# Altium project EVB-NORA-B2.PrjPcb (part 2 of 2)

## Sheet EVB-NORA-B2_SCHEM_0006_PinHeaders_ULED.SchDoc
size A3; DocumentNumber: 4; SheetNumber: 7; SheetTotal: 8
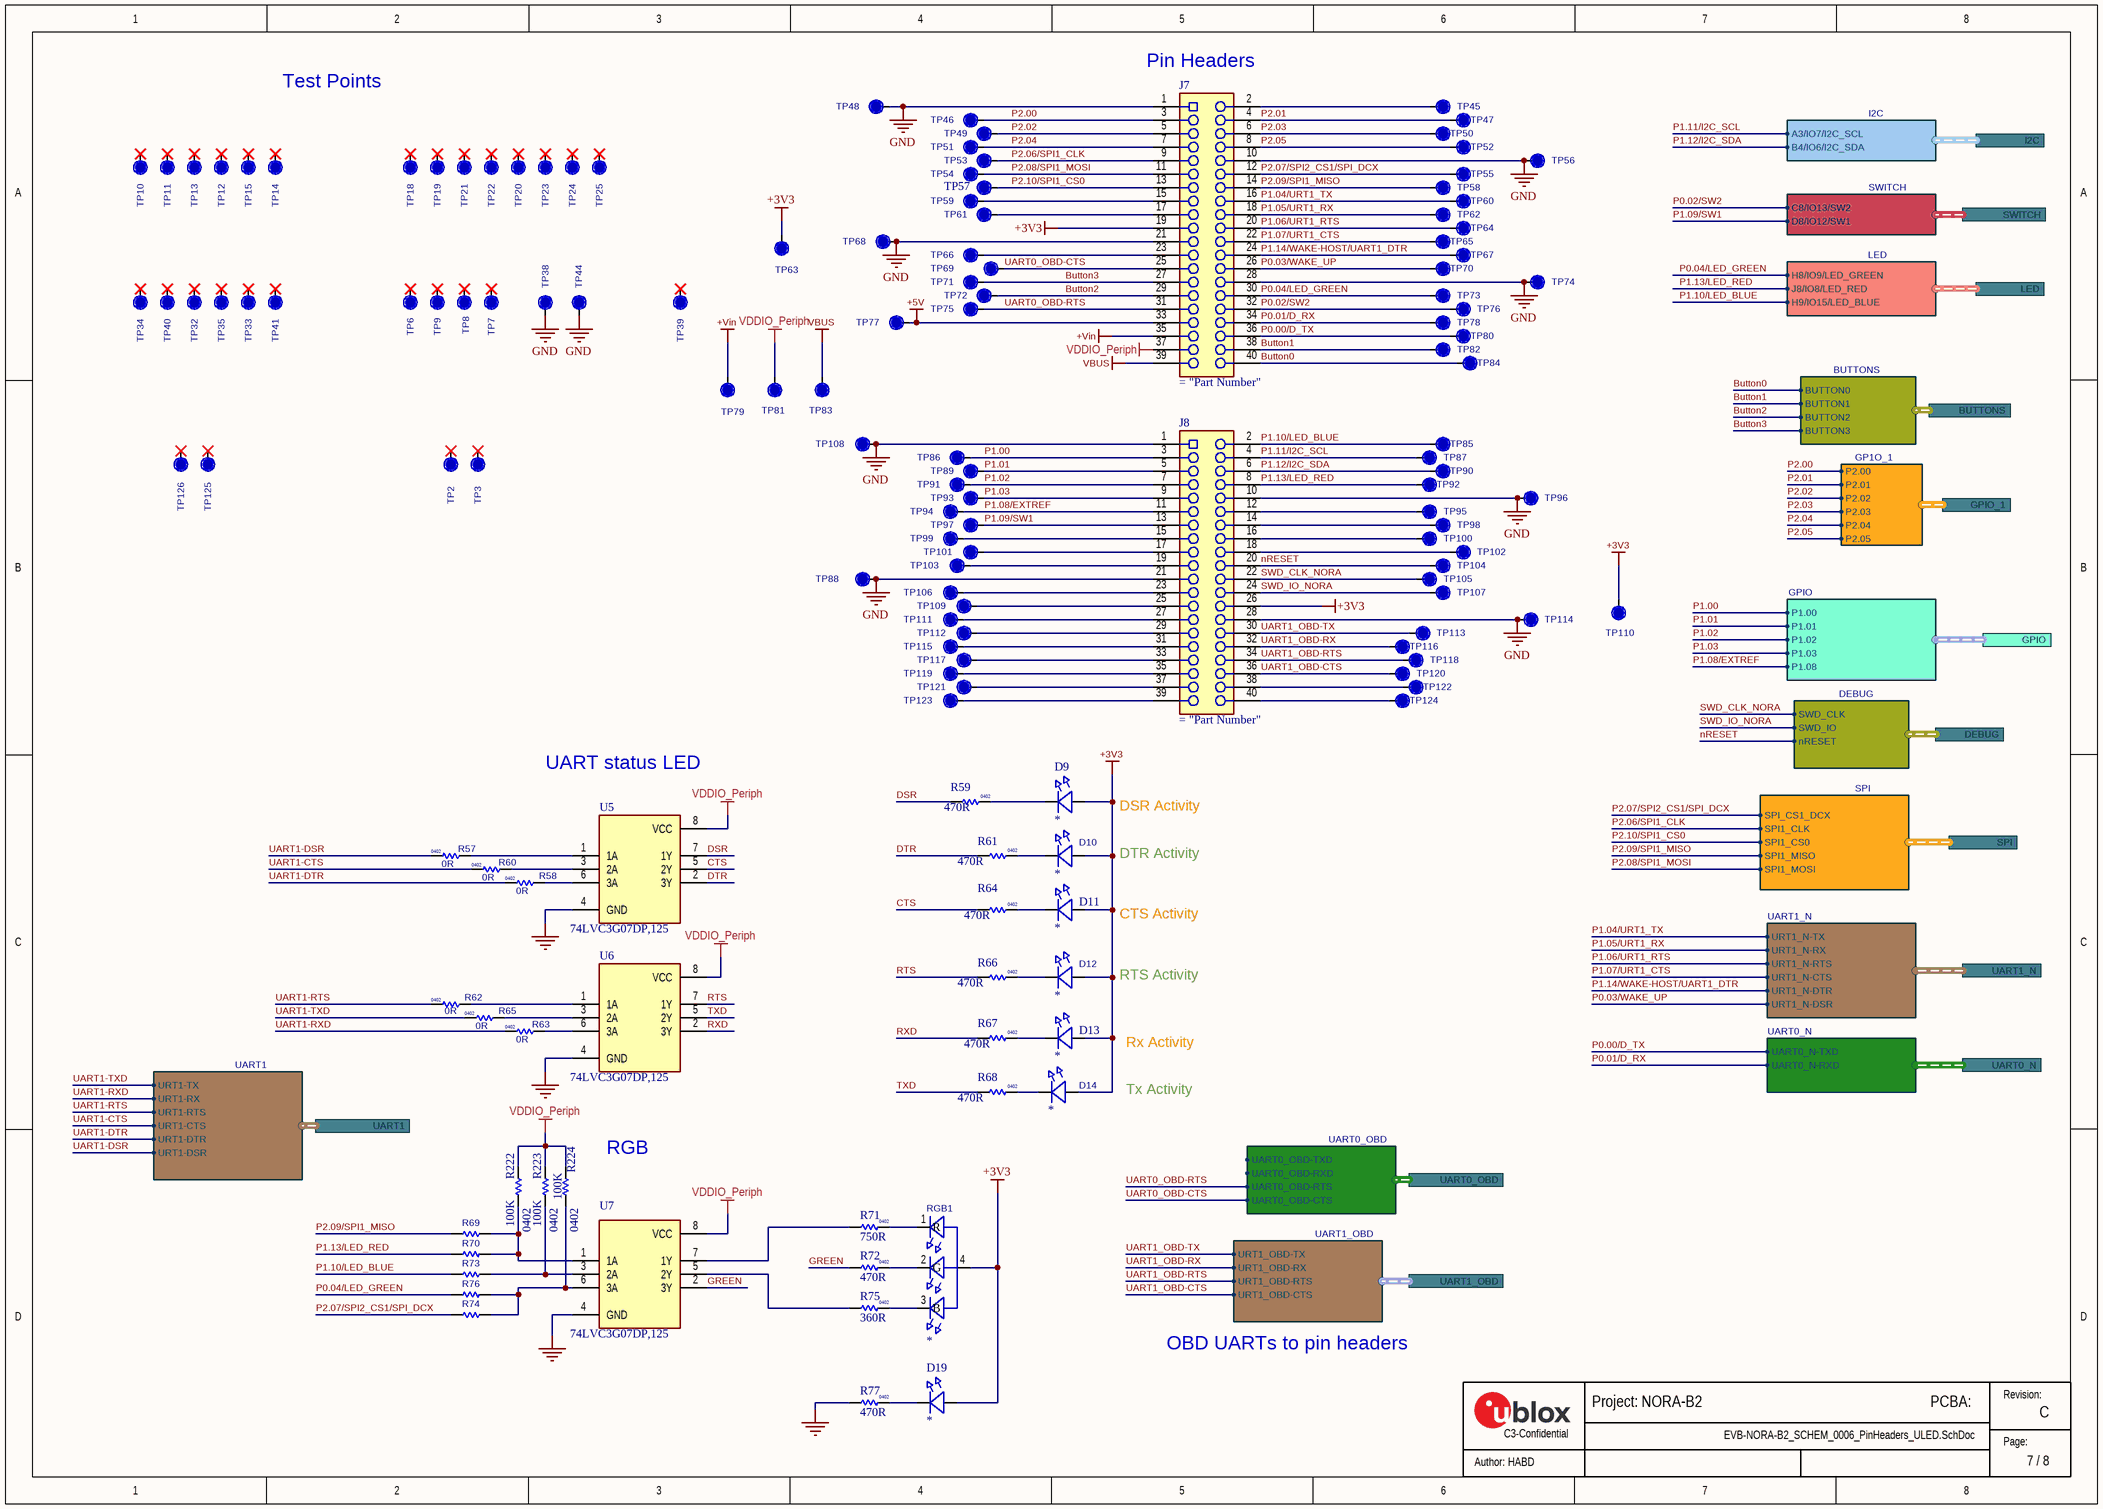
[diagram p3: EVB-NORA-B2_SCHEM_0006_PinHeaders_ULED.SchDoc]

### Parts
D9  UBXH11-0000057  [LED_0603_YELLOW]  (value not drawn)
D10  UBXH11-0000001  [LED_0603_GREEN]  (value not drawn)
D11  UBXH11-0000057  [LED_0603_YELLOW]  (value not drawn)
D12  UBXH11-0000001  [LED_0603_GREEN]  (value not drawn)
D13  UBXH11-0000057  [LED_0603_YELLOW]  (value not drawn)
D14  UBXH11-0000001  [LED_0603_GREEN]  (value not drawn)
D19  UBXH11-0000018  [LED_0603_1600Lx800Wx400H_600x800Pad_800G_FLX]  (value not drawn)
J7  (no value)  [M208762042]
J8  (no value)  [M208762042]
R57  value 0R  Size: 0402  [RES 0402 HD]  (hidden comment: UBXH18-0003002)
R58  value 0R  Size: 0402  [RES 0402 HD]  (hidden comment: UBXH18-0003002)
R59  value 470R  Size: 0402  [RES_0402_1100Lx600Wx400H_500x600Pad_400G_FLX]  (hidden comment: UBXH18-0008041)
R60  value 0R  Size: 0402  [RES 0402 HD]  (hidden comment: UBXH18-0003002)
R61  value 470R  Size: 0402  [RES_0402_1100Lx600Wx400H_500x600Pad_400G_FLX]  (hidden comment: UBXH18-0008041)
R62  value 0R  Size: 0402  [RES 0402 HD]  (hidden comment: UBXH18-0003002)
R63  value 0R  Size: 0402  [RES 0402 HD]  (hidden comment: UBXH18-0003002)
R64  value 470R  Size: 0402  [RES_0402_1100Lx600Wx400H_500x600Pad_400G_FLX]  (hidden comment: UBXH18-0008041)
R65  value 0R  Size: 0402  [RES 0402 HD]  (hidden comment: UBXH18-0003002)
R66  value 470R  Size: 0402  [RES_0402_1100Lx600Wx400H_500x600Pad_400G_FLX]  (hidden comment: UBXH18-0008041)
R67  value 470R  Size: 0402  [RES_0402_1100Lx600Wx400H_500x600Pad_400G_FLX]  (hidden comment: UBXH18-0008041)
R68  value 470R  Size: 0402  [RES_0402_1100Lx600Wx400H_500x600Pad_400G_FLX]  (hidden comment: UBXH18-0008041)
R69  UBXH18-0003002  [RES 0402 HD]  (value not drawn)
R70  UBXH18-0003002  [RES 0402 HD]  (value not drawn)
R71  value 750R  Size: 0402  [RES_0402_1100Lx600Wx400H_500x600Pad_400G_FLX]  (hidden comment: UBXH18-0008046)
R72  value 470R  Size: 0402  [RES_0402_1100Lx600Wx400H_500x600Pad_400G_FLX]  (hidden comment: UBXH18-0008041)
R73  UBXH18-0003002  [RES 0402 HD]  (value not drawn)
R74  UBXH18-0003002  [RES 0402 HD]  (value not drawn)
R75  value 360R  Size: 0402  [RES_0402_1100Lx600Wx400H_500x600Pad_400G_FLX]  (hidden comment: UBXH18-0000216)
R76  UBXH18-0003002  [RES 0402 HD]  (value not drawn)
R77  value 470R  Size: 0402  [RES_0402_1100Lx600Wx400H_500x600Pad_400G_FLX]  (hidden comment: UBXH18-0008041)
R222  value 100K  Size: 0402  [RES 0402 HD]  (hidden comment: UBXH18-0000005)
R223  value 100K  Size: 0402  [RES 0402 HD]  (hidden comment: UBXH18-0000005)
R224  value 100K  Size: 0402  [RES 0402 HD]  (hidden comment: UBXH18-0000005)
RGB1  115-00026  [LED_1616]  (value not drawn)
TP2  TP10R  [TP10R]  (value not drawn)  (no BOM)
TP3  TP10R  [TP10R]  (value not drawn)  (no BOM)
TP6  TP10R  [TP10R]  (value not drawn)  (no BOM)
TP7  TP10R  [TP10R]  (value not drawn)  (no BOM)
TP8  TP10R  [TP10R]  (value not drawn)  (no BOM)
TP9  TP10R  [TP10R]  (value not drawn)  (no BOM)
TP10  TP10R  [TP10R]  (value not drawn)  (no BOM)
TP11  TP10R  [TP10R]  (value not drawn)  (no BOM)
TP12  TP10R  [TP10R]  (value not drawn)  (no BOM)
TP13  TP10R  [TP10R]  (value not drawn)  (no BOM)
TP14  TP10R  [TP10R]  (value not drawn)  (no BOM)
TP15  TP10R  [TP10R]  (value not drawn)  (no BOM)
TP18  TP10R  [TP10R]  (value not drawn)  (no BOM)
TP19  TP10R  [TP10R]  (value not drawn)  (no BOM)
TP20  TP10R  [TP10R]  (value not drawn)  (no BOM)
TP21  TP10R  [TP10R]  (value not drawn)  (no BOM)
TP22  TP10R  [TP10R]  (value not drawn)  (no BOM)
TP23  TP10R  [TP10R]  (value not drawn)  (no BOM)
TP24  TP10R  [TP10R]  (value not drawn)  (no BOM)
TP25  TP10R  [TP10R]  (value not drawn)  (no BOM)
TP32  TP10R  [TP10R]  (value not drawn)  (no BOM)
TP33  TP10R  [TP10R]  (value not drawn)  (no BOM)
TP34  TP10R  [TP10R]  (value not drawn)  (no BOM)
TP35  TP10R  [TP10R]  (value not drawn)  (no BOM)
TP38  TP10R  [TP10R]  (value not drawn)  (no BOM)
TP39  TP10R  [TP10R]  (value not drawn)  (no BOM)
TP40  TP10R  [TP10R]  (value not drawn)  (no BOM)
TP41  TP10R  [TP10R]  (value not drawn)  (no BOM)
TP44  TP10R  [TP10R]  (value not drawn)  (no BOM)
TP45  TP10R  [TP10R]  (value not drawn)  (no BOM)
TP46  TP10R  [TP10R]  (value not drawn)  (no BOM)
TP47  TP10R  [TP10R]  (value not drawn)  (no BOM)
TP48  TP10R  [TP10R]  (value not drawn)  (no BOM)
TP49  TP10R  [TP10R]  (value not drawn)  (no BOM)
TP50  TP10R  [TP10R]  (value not drawn)  (no BOM)
TP51  TP10R  [TP10R]  (value not drawn)  (no BOM)
TP52  TP10R  [TP10R]  (value not drawn)  (no BOM)
TP53  TP10R  [TP10R]  (value not drawn)  (no BOM)
TP54  TP10R  [TP10R]  (value not drawn)  (no BOM)
TP55  TP10R  [TP10R]  (value not drawn)  (no BOM)
TP56  TP10R  [TP10R]  (value not drawn)  (no BOM)
TP57  TP10R  [TP10R]  (value not drawn)
TP58  TP10R  [TP10R]  (value not drawn)  (no BOM)
TP59  TP10R  [TP10R]  (value not drawn)  (no BOM)
TP60  TP10R  [TP10R]  (value not drawn)  (no BOM)
TP61  TP10R  [TP10R]  (value not drawn)  (no BOM)
TP62  TP10R  [TP10R]  (value not drawn)  (no BOM)
TP63  TP10R  [TP10R]  (value not drawn)  (no BOM)
TP64  TP10R  [TP10R]  (value not drawn)  (no BOM)
TP65  TP10R  [TP10R]  (value not drawn)  (no BOM)
TP66  TP10R  [TP10R]  (value not drawn)  (no BOM)
TP67  TP10R  [TP10R]  (value not drawn)  (no BOM)
TP68  TP10R  [TP10R]  (value not drawn)  (no BOM)
TP69  TP10R  [TP10R]  (value not drawn)  (no BOM)
TP70  TP10R  [TP10R]  (value not drawn)  (no BOM)
TP71  TP10R  [TP10R]  (value not drawn)  (no BOM)
TP72  TP10R  [TP10R]  (value not drawn)  (no BOM)
TP73  TP10R  [TP10R]  (value not drawn)  (no BOM)
TP74  TP10R  [TP10R]  (value not drawn)  (no BOM)
TP75  TP10R  [TP10R]  (value not drawn)  (no BOM)
TP76  TP10R  [TP10R]  (value not drawn)  (no BOM)
TP77  TP10R  [TP10R]  (value not drawn)  (no BOM)
TP78  TP10R  [TP10R]  (value not drawn)  (no BOM)
TP79  TP10R  [TP10R]  (value not drawn)  (no BOM)
TP80  TP10R  [TP10R]  (value not drawn)  (no BOM)
TP81  TP10R  [TP10R]  (value not drawn)  (no BOM)
TP82  TP10R  [TP10R]  (value not drawn)  (no BOM)
TP83  TP10R  [TP10R]  (value not drawn)  (no BOM)
TP84  TP10R  [TP10R]  (value not drawn)  (no BOM)
TP85  TP10R  [TP10R]  (value not drawn)  (no BOM)
TP86  TP10R  [TP10R]  (value not drawn)  (no BOM)
TP87  TP10R  [TP10R]  (value not drawn)  (no BOM)
TP88  TP10R  [TP10R]  (value not drawn)  (no BOM)
TP89  TP10R  [TP10R]  (value not drawn)  (no BOM)
TP90  TP10R  [TP10R]  (value not drawn)  (no BOM)
TP91  TP10R  [TP10R]  (value not drawn)  (no BOM)
TP92  TP10R  [TP10R]  (value not drawn)  (no BOM)
TP93  TP10R  [TP10R]  (value not drawn)  (no BOM)
TP94  TP10R  [TP10R]  (value not drawn)  (no BOM)
TP95  TP10R  [TP10R]  (value not drawn)  (no BOM)
TP96  TP10R  [TP10R]  (value not drawn)  (no BOM)
TP97  TP10R  [TP10R]  (value not drawn)  (no BOM)
TP98  TP10R  [TP10R]  (value not drawn)  (no BOM)
TP99  TP10R  [TP10R]  (value not drawn)  (no BOM)
TP100  TP10R  [TP10R]  (value not drawn)  (no BOM)
TP101  TP10R  [TP10R]  (value not drawn)  (no BOM)
TP102  TP10R  [TP10R]  (value not drawn)  (no BOM)
TP103  TP10R  [TP10R]  (value not drawn)  (no BOM)
TP104  TP10R  [TP10R]  (value not drawn)  (no BOM)
TP105  TP10R  [TP10R]  (value not drawn)  (no BOM)
TP106  TP10R  [TP10R]  (value not drawn)  (no BOM)
TP107  TP10R  [TP10R]  (value not drawn)  (no BOM)
TP108  TP10R  [TP10R]  (value not drawn)  (no BOM)
TP109  TP10R  [TP10R]  (value not drawn)  (no BOM)
TP110  TP10R  [TP10R]  (value not drawn)  (no BOM)
TP111  TP10R  [TP10R]  (value not drawn)  (no BOM)
TP112  TP10R  [TP10R]  (value not drawn)  (no BOM)
TP113  TP10R  [TP10R]  (value not drawn)  (no BOM)
TP114  TP10R  [TP10R]  (value not drawn)  (no BOM)
TP115  TP10R  [TP10R]  (value not drawn)  (no BOM)
TP116  TP10R  [TP10R]  (value not drawn)  (no BOM)
TP117  TP10R  [TP10R]  (value not drawn)  (no BOM)
TP118  TP10R  [TP10R]  (value not drawn)  (no BOM)
TP119  TP10R  [TP10R]  (value not drawn)  (no BOM)
TP120  TP10R  [TP10R]  (value not drawn)  (no BOM)
TP121  TP10R  [TP10R]  (value not drawn)  (no BOM)
TP122  TP10R  [TP10R]  (value not drawn)  (no BOM)
TP123  TP10R  [TP10R]  (value not drawn)  (no BOM)
TP124  TP10R  [TP10R]  (value not drawn)  (no BOM)
TP125  TP10R  [TP10R]  (value not drawn)  (no BOM)
TP126  TP10R  [TP10R]  (value not drawn)  (no BOM)
U5  UBXH06-0000120  [SOP65P400X110-8N]  (value not drawn)
U6  UBXH06-0000120  [SOP65P400X110-8N]  (value not drawn)
U7  UBXH06-0000120  [SOP65P400X110-8N]  (value not drawn)

### Ports
BUTTONS (harness BUTTONS), DEBUG (harness Debug), GPIO (harness GPIO), GPIO_1 (harness GP1O_1), I2C (harness I2C), LED (harness LED), SPI (harness SPI), SWITCH (harness SWITCH), UART0_N (harness UART0_N), UART0_OBD (harness UART0_OBD), UART1 (harness UART1), UART1_N (harness UART1_N), UART1_OBD (harness UART1_OBD)

### Harnesses
I2C: A3/IO7/I2C_SCL, B4/IO6/I2C_SDA
SWITCH: C8/IO13/SW2, D8/IO12/SW1
LED: H9/IO15/LED_BLUE, J8/IO8/LED_RED, H8/IO9/LED_GREEN
SPI: SPI_CS1_DCX, SPI1_CLK, SPI1_CS0, SPI1_MISO, SPI1_MOSI
DEBUG: nRESET, SWD_IO, SWD_CLK
BUTTONS: BUTTON2, BUTTON1, BUTTON0, BUTTON3
GP1O_1: P2.00, P2.01, P2.02, P2.03, P2.04, P2.05
UART0_N: UART0_N-TXD, UART0_N-RXD
GPIO: P1.00, P1.01, P1.02, P1.08, P1.03
UART1: URT1-RTS, URT1-CTS, URT1-TX, URT1-RX, URT1-DTR, URT1-DSR
UART1_N: URT1_N-RTS, URT1_N-CTS, URT1_N-TX, URT1_N-RX, URT1_N-DTR, URT1_N-DSR
UART1_OBD: URT1_OBD-RTS, URT1_OBD-CTS, URT1_OBD-TX, URT1_OBD-RX
UART0_OBD: UART0_OBD-TXD, UART0_OBD-RXD, UART0_OBD-RTS, UART0_OBD-CTS

### Nets
+3V3: D9.2(A) D10.2(A) D11.2(A) D12.2(A) D13.2(A) D14.2(A) D19.2(A) J7.19 J8.26 RGB1.4(A) TP63.1 TP110.1
+5V: J7.33 TP77.1
+Vin: J7.35 TP79.1
GND: J7.1 J7.10 J7.21 J7.28 J8.1 J8.10 J8.21 J8.28 R77.1 TP38.1 TP44.1 TP48.1 TP56.1 TP68.1 TP74.1 TP88.1 TP96.1 TP108.1 TP114.1 U5.4(GND) U6.4(GND) U7.4(GND)
VBUS: J7.39 TP83.1
VDDIO_Periph: J7.37 R222.1 R223.1 R224.1 TP81.1 U5.8(VCC) U6.8(VCC) U7.8(VCC)
Button0: J7.40 TP84.1 ; port BUTTONS.BUTTON0
Button1: J7.38 TP82.1 ; port BUTTONS.BUTTON1
Button2: J7.29 TP72.1 ; port BUTTONS.BUTTON2
Button3: J7.27 TP71.1 ; port BUTTONS.BUTTON3
CTS: R64.1 U5.5(2Y)
DSR: R59.1 U5.7(1Y)
DTR: R61.1 U5.2(3Y)
GREEN: R72.1 U7.2(3Y)
nRESET: J8.20 TP104.1 ; port DEBUG.nRESET
P0.00/D_TX: J7.36 TP80.1 ; port UART0_N.UART0_N-TXD
P0.01/D_RX: J7.34 TP78.1 ; port UART0_N.UART0_N-RXD
P0.02/SW2: J7.32 TP76.1 ; port SWITCH.C8/IO13/SW2
P0.03/WAKE_UP: J7.26 TP70.1 ; port UART1_N.URT1_N-DSR
P0.04/LED_GREEN: J7.30 R76.2 TP73.1 ; port LED.H8/IO9/LED_GREEN
P1.00: J8.3 TP86.1 ; port GPIO.P1.00
P1.01: J8.5 TP89.1 ; port GPIO.P1.01
P1.02: J8.7 TP91.1 ; port GPIO.P1.02
P1.03: J8.9 TP93.1 ; port GPIO.P1.03
P1.04/URT1_TX: J7.16 TP60.1 ; port UART1_N.URT1_N-TX
P1.05/URT1_RX: J7.18 TP62.1 ; port UART1_N.URT1_N-RX
P1.06/URT1_RTS: J7.20 TP64.1 ; port UART1_N.URT1_N-RTS
P1.07/URT1_CTS: J7.22 TP65.1 ; port UART1_N.URT1_N-CTS
P1.08/EXTREF: J8.11 TP94.1 ; port GPIO.P1.08
P1.09/SW1: J8.13 TP97.1 ; port SWITCH.D8/IO12/SW1
P1.10/LED_BLUE: J8.2 R73.2 TP85.1 ; port LED.H9/IO15/LED_BLUE
P1.11/I2C_SCL: J8.4 TP87.1 ; port I2C.A3/IO7/I2C_SCL
P1.12/I2C_SDA: J8.6 TP90.1 ; port I2C.B4/IO6/I2C_SDA
P1.13/LED_RED: J8.8 R70.2 TP92.1 ; port LED.J8/IO8/LED_RED
P1.14/WAKE-HOST/UART1_DTR: J7.24 TP67.1 ; port UART1_N.URT1_N-DTR
P2.00: J7.3 TP46.1 ; port GPIO_1.P2.00
P2.01: J7.4 TP47.1 ; port GPIO_1.P2.01
P2.02: J7.5 TP49.1 ; port GPIO_1.P2.02
P2.03: J7.6 TP50.1 ; port GPIO_1.P2.03
P2.04: J7.7 TP51.1 ; port GPIO_1.P2.04
P2.05: J7.8 TP52.1 ; port GPIO_1.P2.05
P2.06/SPI1_CLK: J7.9 TP53.1 ; port SPI.SPI1_CLK
P2.07/SPI2_CS1/SPI_DCX: J7.12 R74.2 TP55.1 ; port SPI.SPI_CS1_DCX
P2.08/SPI1_MOSI: J7.11 TP54.1 ; port SPI.SPI1_MOSI
P2.09/SPI1_MISO: J7.14 R69.2 TP58.1 ; port SPI.SPI1_MISO
P2.10/SPI1_CS0: J7.13 TP57.1 ; port SPI.SPI1_CS0
RTS: R66.1 U6.7(1Y)
RXD: R67.1 U6.2(3Y)
SWD_CLK_NORA: J8.22 TP105.1 ; port DEBUG.SWD_CLK
SWD_IO_NORA: J8.24 TP107.1 ; port DEBUG.SWD_IO
TXD: R68.1 U6.5(2Y)
UART0_OBD-CTS: J7.25 TP69.1 ; port UART0_OBD.UART0_OBD-CTS
UART0_OBD-RTS: J7.31 TP75.1 ; port UART0_OBD.UART0_OBD-RTS
UART1-CTS: R60.2 ; port UART1.URT1-CTS
UART1-DSR: R57.2 ; port UART1.URT1-DSR
UART1-DTR: R58.2 ; port UART1.URT1-DTR
UART1-RTS: R62.2 ; port UART1.URT1-RTS
UART1-RXD: R63.2 ; port UART1.URT1-RX
UART1-TXD: R65.2 ; port UART1.URT1-TX
UART1_OBD-CTS: J8.36 TP120.1 ; port UART1_OBD.URT1_OBD-CTS
UART1_OBD-RTS: J8.34 TP118.1 ; port UART1_OBD.URT1_OBD-RTS
UART1_OBD-RX: J8.32 TP116.1 ; port UART1_OBD.URT1_OBD-RX
UART1_OBD-TX: J8.30 TP113.1 ; port UART1_OBD.URT1_OBD-TX
NetD9_1: D9.1(C) R59.2
NetD10_1: D10.1(C) R61.2
NetD11_1: D11.1(C) R64.2
NetD12_1: D12.1(C) R66.2
NetD13_1: D13.1(C) R67.2
NetD14_1: D14.1(C) R68.2
NetD19_1: D19.1(C) R77.2
NetJ7_2: J7.2 TP45.1
NetJ7_15: J7.15 TP59.1
NetJ7_17: J7.17 TP61.1
NetJ7_23: J7.23 TP66.1
NetJ8_12: J8.12 TP95.1
NetJ8_14: J8.14 TP98.1
NetJ8_15: J8.15 TP99.1
NetJ8_16: J8.16 TP100.1
NetJ8_17: J8.17 TP101.1
NetJ8_18: J8.18 TP102.1
NetJ8_19: J8.19 TP103.1
NetJ8_23: J8.23 TP106.1
NetJ8_25: J8.25 TP109.1
NetJ8_27: J8.27 TP111.1
NetJ8_29: J8.29 TP112.1
NetJ8_31: J8.31 TP115.1
NetJ8_33: J8.33 TP117.1
NetJ8_35: J8.35 TP119.1
NetJ8_37: J8.37 TP121.1
NetJ8_38: J8.38 TP122.1
NetJ8_39: J8.39 TP123.1
NetJ8_40: J8.40 TP124.1
NetR57_1: R57.1 U5.1(1A)
NetR58_1: R58.1 U5.6(3A)
NetR60_1: R60.1 U5.3(2A)
NetR62_1: R62.1 U6.1(1A)
NetR63_1: R63.1 U6.6(3A)
NetR65_1: R65.1 U6.3(2A)
NetR69_1: R69.1 R70.1 R222.2 U7.1(1A)
NetR71_1: R71.1 U7.7(1Y)
NetR71_2: R71.2 RGB1.1(R)
NetR72_2: R72.2 RGB1.2(G)
NetR73_1: R73.1 R223.2 U7.3(2A)
NetR74_1: R74.1 R76.1 R224.2 U7.6(3A)
NetR75_1: R75.1 U7.5(2Y)
NetR75_2: R75.2 RGB1.3(B)

Not connected (* = marked no-connect by the designer): TP2 1*; TP3 1*; TP6 1*; TP7 1*; TP8 1*; TP9 1*; TP10 1*; TP11 1*; TP12 1*; TP13 1*; TP14 1*; TP15 1*; TP18 1*; TP19 1*; TP20 1*; TP21 1*; TP22 1*; TP23 1*; TP24 1*; TP25 1*; TP32 1*; TP33 1*; TP34 1*; TP35 1*; TP39 1*; TP40 1*; TP41 1*; TP125 1*; TP126 1*

### Notes on the sheet
- Test Points
- (near J7) Pin Headers
- UART status LED
- DTR Activity
- DSR Activity
- CTS Activity
- RTS Activity
- Rx Activity
- Tx Activity
- RGB
- OBD UARTs to pin headers
- Revision:
- C3-Confidential
- Page:

### Library data of the parts
D9 D11 D13 = UBXH11-0000057: DIODE LED SMT YELLOW CLEAR LENS 2.1V 10MA 0603 YELLOW; Manufacturer: Lite-on Technology Corporation; Manufacturer P/N: LTST-C190YKT; Editor: eric.moog; Env: GREEN; Permitted Use: Volume Products; Mfg P/N Status: Active; Mfg P/N Split: 100; Mfg P/N Released: No; Color: *; Part Number: UBXH11-0000057; Value: YELLOW; Size: 0603; Min Operating Temp: -55°C; Max Operating Temp: 85°C; Part Type: LED; UBX Wiki: https://wiki.u-blox.com/bin/view/Operations/PartDetails?index=38120; Perferred: N/A; RefDes: DS; Mfg P/N Datasheet: https://wiki.u-blox.com/bin/view/Generic/Docs/DocumentSummary?index=38122
D10 D12 D14 = UBXH11-0000001: LED SMD 0603 GREEN 2.5V 20mA; Manufacturer: Kingbright; Manufacturer P/N: APT1608SGC; Editor: gianni.falleroni; Released by: alex.claville; Env: ROHS; Permitted Use: Support Products; Mfg P/N Status: Active; Mfg P/N Split: 50; Mfg P/N Released: Yes; Color: *; Part Number: UBXH11-0000001; Value: GREEN; Max Voltage: 2.5V; Max Current: 20mA; Size: 0603; Part Type: LED; Release Data: 2022-09-27T14:26:54; UBX Wiki: https://wiki.u-blox.com/bin/view/Operations/PartDetails?index=7902; Perferred: N/A; RefDes: DS; Mfg P/N Datasheet: https://wiki.u-blox.com/bin/view/Generic/Docs/DocumentSummary?index=37527; Manufacturer 2: Lite-on Technology Corporation; Manufacturer P/N 2: LTST-C190KGKT; Mfg P/N Status 2: Active; Mfg P/N Split 2: 50; Mfg P/N Released 2: Yes; Mfg P/N Datasheet 2: https://wiki.u-blox.com/bin/view/Generic/Docs/DocumentSummary?index=16220
D19 = UBXH11-0000018: LED CHIP 0603 LOW CURRENT OSRAM 0.002A GREEN 2.2V 2mA; Manufacturer P/N: LG L29K-G2J1-24; Editor: johann.furrer; Released by: martin.grasse; Env: ROHS; Permitted Use: Volume Products; Perferred: PREF; Mfg P/N Status: NRND; Mfg P/N Split: 100; Mfg P/N Released: Yes; Color: *; Part Number: UBXH11-0000018; Value: GREEN; Max Voltage: 2.2V; Max Current: 2mA; Size: 0603; Min Operating Temp: -40°C; Max Operating Temp: 85°C; Part Type: LED; Release Data: 2018-01-09T15:31:38; UBX Wiki: https://wiki.u-blox.com/bin/view/Operations/PartDetails?index=20619; RefDes: DS; Manufacturer: Osram; Mfg P/N Datasheet: https://wiki.u-blox.com/bin/view/Generic/Docs/DocumentSummary?index=20620
J7 J8 = M20-8762042: Connector; Manufacturer_Name: Harwin; Datasheet Link: https://cdn.harwin.com/pdfs/M20-876.pdf; Height: 10.01mm; Manufacturer_Part_Number: M20-8762042; Mouser Part Number: 855-M20-8762042; Mouser Price/Stock: https://www.mouser.co.uk/ProductDetail/Harwin/M20-8762042?qs=vF78I%252BjhbY%2F5WnwPzhFszw%3D%3D
R57 R58 R60 R62 R63 R65 R69 R70 R73 R74 R76 = UBXH18-0003002: RES THICK FILM CHIP 0402 0R 0 100mW; Manufacturer: KOA; Manufacturer P/N: RK73Z1ETTP; Tolerance: 0; Editor: charlotte.biber; Released by: peter.mueller; Env: ROHS; Permitted Use: Volume Products; Perferred: PREF; Mfg P/N Status: NRND; Mfg P/N Split: 100; Mfg P/N Released: Yes; Part Number: UBXH18-0003002; Max Power: 100mW; Part Type: Resistor; Release Data: 2012-06-05 09:49:55.978616; UBX Wiki: https://wiki.u-blox.com/bin/view/Operations/PartDetails?index=6611; RefDes: R; Manufacturer 2: YAGEO; Manufacturer P/N 2: 2322_705_91001_L; Mfg P/N Status 2: NRND; Mfg P/N Split 2: 0; Mfg P/N Released 2: Yes
  R69 R70 R73 R74 R76: Value: 0R; Size: 0402
R59 R61 R64 R66-R68 R72 R77 = UBXH18-0008041: RES THICK FILM CHIP 0402 470R 5% 100mW; Manufacturer: ROHM; Manufacturer P/N: MCR01MZPJ471; Editor: roland.rust; Env: ROHS; Permitted Use: Volume Products; Perferred: PREF; Mfg P/N Status: Obsolete; Mfg P/N Split: 100; Mfg P/N Released: Yes; Part Number: UBXH18-0008041; Tolerance: 5%; Max Power: 100mW; Part Type: Resistor; Released by: roland.rust; Release Data: 2009-04-24T14:36:39; UBX Wiki: https://wiki.u-blox.com/bin/view/Operations/PartDetails?index=6926; RefDes: R; Manufacturer 2: KOA; Manufacturer P/N 2: RK73B1ETTP471J; Mfg P/N Status 2: Active; Mfg P/N Split 2: 0; Mfg P/N Released 2: Yes; Manufacturer 3: YAGEO; Manufacturer P/N 3: 2322_705_87471_L; Mfg P/N Status 3: Obsolete; Mfg P/N Split 3: 0; Mfg P/N Released 3: Yes
R71 = UBXH18-0008046: RES THICK FILM CHIP 0402 750R 5% 100mW; Manufacturer: Panasonic; Manufacturer P/N: ERJ2GEJ751X; Editor: jaka.bevk; Released by: erian.bezhani; Env: ROHS; Permitted Use: Volume Products; Perferred: PREF; Mfg P/N Status: Active; Mfg P/N Split: 100; Mfg P/N Released: Yes; Part Number: UBXH18-0008046; Tolerance: 5%; Max Power: 100mW; Part Type: Resistor; Release Data: 2014-10-03T09:31:33; UBX Wiki: https://wiki.u-blox.com/bin/view/Operations/PartDetails?index=6935; RefDes: R; Mfg P/N Datasheet: https://wiki.u-blox.com/bin/view/Generic/Docs/DocumentSummary?index=21267
R75 = UBXH18-0000216: RES THICK FILM CHIP 0402 360R 1% 63mW; Manufacturer: KOA; Manufacturer P/N: RK73H1ETTP3600F; Editor: michael.hein; Released by: vasyl.dykyy; Env: ROHS; Permitted Use: Volume Products; Perferred: PREF; Mfg P/N Status: Active; Mfg P/N Split: 100; Mfg P/N Released: Yes; Part Number: UBXH18-0000216; Tolerance: 1%; Max Power: 63mW; Part Type: Resistor; Release Data: 2015-10-02T11:55:45; Automotive: Yes; UBX Wiki: https://wiki.u-blox.com/bin/view/Operations/PartDetails?index=23306; RefDes: R; Mfg P/N Datasheet: https://wiki.u-blox.com/bin/view/Generic/Docs/DocumentSummary?index=8222
R222-R224 = UBXH18-0000005: RES THICK FILM CHIP 0402 100K 1% 63mW; Manufacturer: KOA; Manufacturer P/N: RK73H1ETTP1003F; Editor: dario.antonaz; Released by: sandro.sestan; Env: ROHS; Permitted Use: Volume Products; Mfg P/N Status: Active; Mfg P/N Split: 100; Mfg P/N Released: Yes; Part Number: UBXH18-0000005; Tolerance: 1%; Max Power: 63mW; Part Type: Resistor; Release Data: 2009-11-30T11:05:22; UBX Wiki: https://wiki.u-blox.com/bin/view/Operations/PartDetails?index=8114; Perferred: N/A; RefDes: R; Manufacturer 2: YAGEO; Manufacturer P/N 2: RC0402FR-07100KL; Mfg P/N Status 2: Active; Mfg P/N Split 2: 0; Mfg P/N Released 2: Yes; Case/Package: 0x0y; Mfg P/N Datasheet: https://wiki.u-blox.com/bin/view/Generic/Docs/DocumentSummary?index=8222; Mfg P/N Datasheet 2: https://wiki.u-blox.com/bin/view/Generic/Docs/DocumentSummary?index=29373; Manufacturer 3: ROHM; Manufacturer P/N 3: MCR01MZPF1003; Mfg P/N Status 3: Obsolete; Mfg P/N Split 3: 0; Mfg P/N Released 3: Yes; Mfg P/N Datasheet 3: https://wiki.u-blox.com/bin/view/Generic/Docs/DocumentSummary?index=8186
RGB1 = 115-00026: LED RGB SMT 0606; Manufacturer 1: Lite-On Inc; Manufacturer Part Number 1: LTST-C19HE1WT; Body Size: 1.6mm x 1.6mm; Current: 20mA; Item Phase: In Production; MFG Package: 0606; Use in new designs: Yes; Voltage: None; Color: *; Part Number: 115-00026; Supplier 1: Digi-Key; Supplier Part Number 1: 160-2162-1-ND; Height: 0.35mm; Max Operating Temp: 80; Min Operating Temp: -20; Part Name: LED RGB SMT 0606; Pins: 4; Revision: 0B; Size: Other; UBX Code: None; Supplier 2: Digi-Key; Supplier Part Number 2: 1516-1184-1-ND
TP2 TP3 TP6-TP15 TP18-TP25 TP32-TP35 TP38-TP41 TP44-TP126 = TP10R: Testpoint, Round 1.0mm Dia; Added By: Jeremy D; Part Number: TP10R; Size: 1.0mm; Height: 0; DNP: DNP; Checked By: Paul B
  TP2 TP3 TP6-TP15 TP18-TP25 TP32-TP35 TP38-TP41 TP44-TP56 TP58-TP126: Added Date: 2/1/2015; Checked Date: 2/5/2015
  TP57: Added Date: 2015-02-01; Checked Date: 2015-02-05
U5-U7 = UBXH06-0000120: Non-inverting Buffers & Line Drivers 3 Channels /SOT505/TSSOP8 1.65V to 5.5V; Manufacturer_Name: Nexperia; Manufacturer Part Number 1: 74LVC3G07DP; Manufacturer Split 1: 100; Part Phase: Unreleased; Body Size: 3.9mmx 3.1mm; Driver Type: LED; Environmental Grade: RoHS; Min Supply Voltage: 1.65; Owner: Hozaifa Abdelgadir; SMT Pitch: 0.65mm; Single Source: No; Use in new designs: Yes; Datasheet Link: https://assets.nexperia.com/documents/data-sheet/74LVC3G07.pdf; Height: 0.95mm; Manufacturer_Part_Number: 74LVC3G07DP,125; Mouser Part Number: 771-74LVC3G07DP-G; Mouser Price/Stock: https://www.mouser.co.uk/ProductDetail/Nexperia/74LVC3G07DP125?qs=me8TqzrmIYXM25jpSFl3Hg%3D%3D; Arrow Part Number: 74LVC3G07DP,125; Arrow Price/Stock: https://www.arrow.com/en/products/74lvc3g07dp125/nexperia?region=nac; Part Number: UBXH06-0000120; Automotive: No; Case/Package: TSSOP-8; ComponentLink1Description: Arena Link; ComponentLink1Url: https://app.bom.com/3L5OTHPRLN6EXALGUBPR; Manufacturer 1: Nexperia; Max Operating Temp: 125°C; Max Supply Voltage: 5.5V; Min Operating Temp: -40°C; Mounting Type: SMT; Part Name: Non-inverting Buffers & Line Drivers 3 Channels /SOT505/TSSOP8 1.65V to 5.5V; Part Status: Preferred; Part Type: Driver; Pins: 8; Thermal Pad: No; Volume Use: No

## Nets that join several sheets
+3V3: EVB-NORA-B2_SCHEM_0001_Power (6 pins), EVB-NORA-B2_SCHEM_0006_PinHeaders_ULED (12 pins)
+5V: EVB-NORA-B2_SCHEM_0001_Power (R38.2 SW1.4), EVB-NORA-B2_SCHEM_0006_PinHeaders_ULED (J7.33 TP77.1)
+Vin: EVB-NORA-B2_SCHEM_0001_Power (D1.A), EVB-NORA-B2_SCHEM_0006_PinHeaders_ULED (J7.35 TP79.1)
GND: EVB-NORA-B2_SCHEM_0001_Power (40 pins), EVB-NORA-B2_SCHEM_0002_NORA_Module (25 pins), EVB-NORA-B2_SCHEM_0006_PinHeaders_ULED (22 pins)
VBUS: EVB-NORA-B2_SCHEM_0001_Power (R29.1 R38.1 R41.1 SW1.1), EVB-NORA-B2_SCHEM_0006_PinHeaders_ULED (J7.39 TP83.1)
VDD: EVB-NORA-B2_SCHEM_0001_Power (J3.2 R46.1 S1.4), EVB-NORA-B2_SCHEM_0002_NORA_Module (R197.2 TP16.1)
VDDIO_Periph: EVB-NORA-B2_SCHEM_0001_Power (R199.2 S1.3), EVB-NORA-B2_SCHEM_0006_PinHeaders_ULED (8 pins)
nRESET: EVB-NORA-B2_SCHEM_0002_NORA_Module (R14.2), EVB-NORA-B2_SCHEM_0006_PinHeaders_ULED (J8.20 TP104.1)
P0.00/D_TX: EVB-NORA-B2_SCHEM_0002_NORA_Module (R2.1), EVB-NORA-B2_SCHEM_0006_PinHeaders_ULED (J7.36 TP80.1)
P0.01/D_RX: EVB-NORA-B2_SCHEM_0002_NORA_Module (R3.1), EVB-NORA-B2_SCHEM_0006_PinHeaders_ULED (J7.34 TP78.1)
P0.02/SW2: EVB-NORA-B2_SCHEM_0002_NORA_Module (R10.1), EVB-NORA-B2_SCHEM_0006_PinHeaders_ULED (J7.32 TP76.1)
P0.03/WAKE_UP: EVB-NORA-B2_SCHEM_0002_NORA_Module (R12.2), EVB-NORA-B2_SCHEM_0006_PinHeaders_ULED (J7.26 TP70.1)
P0.04/LED_GREEN: EVB-NORA-B2_SCHEM_0002_NORA_Module (R19.2), EVB-NORA-B2_SCHEM_0006_PinHeaders_ULED (J7.30 R76.2 TP73.1)
P1.00: EVB-NORA-B2_SCHEM_0002_NORA_Module (R26.1), EVB-NORA-B2_SCHEM_0006_PinHeaders_ULED (J8.3 TP86.1)
P1.01: EVB-NORA-B2_SCHEM_0002_NORA_Module (R21.1), EVB-NORA-B2_SCHEM_0006_PinHeaders_ULED (J8.5 TP89.1)
P1.04/URT1_TX: EVB-NORA-B2_SCHEM_0002_NORA_Module (R28.2), EVB-NORA-B2_SCHEM_0006_PinHeaders_ULED (J7.16 TP60.1)
P1.05/URT1_RX: EVB-NORA-B2_SCHEM_0002_NORA_Module (R27.2), EVB-NORA-B2_SCHEM_0006_PinHeaders_ULED (J7.18 TP62.1)
P1.06/URT1_RTS: EVB-NORA-B2_SCHEM_0002_NORA_Module (R23.1), EVB-NORA-B2_SCHEM_0006_PinHeaders_ULED (J7.20 TP64.1)
P1.07/URT1_CTS: EVB-NORA-B2_SCHEM_0002_NORA_Module (R24.1), EVB-NORA-B2_SCHEM_0006_PinHeaders_ULED (J7.22 TP65.1)
P1.08/EXTREF: EVB-NORA-B2_SCHEM_0002_NORA_Module (C3.2 R17.1), EVB-NORA-B2_SCHEM_0006_PinHeaders_ULED (J8.11 TP94.1)
P1.09/SW1: EVB-NORA-B2_SCHEM_0002_NORA_Module (R11.1), EVB-NORA-B2_SCHEM_0006_PinHeaders_ULED (J8.13 TP97.1)
P1.10/LED_BLUE: EVB-NORA-B2_SCHEM_0002_NORA_Module (R18.2), EVB-NORA-B2_SCHEM_0006_PinHeaders_ULED (J8.2 R73.2 TP85.1)
P1.11/I2C_SCL: EVB-NORA-B2_SCHEM_0002_NORA_Module (R1.1), EVB-NORA-B2_SCHEM_0006_PinHeaders_ULED (J8.4 TP87.1)
P1.12/I2C_SDA: EVB-NORA-B2_SCHEM_0002_NORA_Module (R6.1), EVB-NORA-B2_SCHEM_0006_PinHeaders_ULED (J8.6 TP90.1)
P1.13/LED_RED: EVB-NORA-B2_SCHEM_0002_NORA_Module (R13.2), EVB-NORA-B2_SCHEM_0006_PinHeaders_ULED (J8.8 R70.2 TP92.1)
P1.14/WAKE-HOST/UART1_DTR: EVB-NORA-B2_SCHEM_0002_NORA_Module (R16.1), EVB-NORA-B2_SCHEM_0006_PinHeaders_ULED (J7.24 TP67.1)
P2.06/SPI1_CLK: EVB-NORA-B2_SCHEM_0002_NORA_Module (R4.1), EVB-NORA-B2_SCHEM_0006_PinHeaders_ULED (J7.9 TP53.1)
P2.07/SPI2_CS1/SPI_DCX: EVB-NORA-B2_SCHEM_0002_NORA_Module (R9.1), EVB-NORA-B2_SCHEM_0006_PinHeaders_ULED (J7.12 R74.2 TP55.1)
P2.08/SPI1_MOSI: EVB-NORA-B2_SCHEM_0002_NORA_Module (R8.1), EVB-NORA-B2_SCHEM_0006_PinHeaders_ULED (J7.11 TP54.1)
P2.09/SPI1_MISO: EVB-NORA-B2_SCHEM_0002_NORA_Module (R7.1), EVB-NORA-B2_SCHEM_0006_PinHeaders_ULED (J7.14 R69.2 TP58.1)
P2.10/SPI1_CS0: EVB-NORA-B2_SCHEM_0002_NORA_Module (R5.1), EVB-NORA-B2_SCHEM_0006_PinHeaders_ULED (J7.13 TP57.1)
SWD_CLK_NORA: EVB-NORA-B2_SCHEM_0002_NORA_Module (R15.2), EVB-NORA-B2_SCHEM_0006_PinHeaders_ULED (J8.22 TP105.1)
SWD_IO_NORA: EVB-NORA-B2_SCHEM_0002_NORA_Module (R22.2), EVB-NORA-B2_SCHEM_0006_PinHeaders_ULED (J8.24 TP107.1)

## Assembly variants
EVB-NORA-B266: not fitted BAT1 C1 C2 C3 C4 C5 C18 C19 C21 C22 C23 C24 C25 C26 C27 C28 C29 C30 C31 C32 C33 C34 C35 C36 C37 C38 C39 C40 C41 C42 C43 C44 C45 C46 C47 C52 C55 C56 C57 C58 C59 C61 C64 C65 C66 C67 D6 D7 D8 D16 D20 D21 J1 J5 J6 J9 J10 J11 J13 J14 J15 J16 J17 J18 J19 J20 Q1 Q3 Q4 R21 R26 R33 R34 R37 R38 R45 R46 R47 R52 R53 R54 R55 R56 R69 R74 R78 R79 R80 R81 R82 R83 R84 R85 R86 R87 R88 R89 R90 R91 R92 R93 R94 R113 R137 R138 R139 R140 R141 R142 R143 R144 R145 R146 R147 R148 R149 R150 R151 R152 R153 R154 R156 R157 R160 R161 R162 R163 R164 R165 R166 R167 R168 R169 R171 R172 R173 R174 R175 R176 R177 R178 R179 R180 R182 R185 R188 R190 R191 R192 R193 R194 R195 R196 R198 R199 R201 R202 R203 R204 R207 R208 R209 R210 R211 R212 R214 R215 SW6 SW7 U8 U9 U10 U11 U12 U13 U14 U16 U17 X2 X3
EVB-NORA-B261: not fitted BAT1 C1 C2 C3 C4 C5 C18 C19 C21 C22 C23 C24 C25 C26 C27 C28 C29 C30 C31 C32 C33 C34 C35 C36 C37 C38 C39 C40 C41 C42 C43 C44 C45 C46 C47 C52 C55 C56 C57 C58 C59 C61 C64 C65 C66 C67 D6 D7 D8 D16 D20 D21 J5 J6 J9 J10 J11 J13 J14 J15 J16 J17 J18 J19 J20 Q1 Q3 Q4 R21 R26 R33 R34 R37 R38 R45 R46 R47 R52 R53 R54 R55 R56 R69 R74 R78 R79 R80 R81 R82 R83 R84 R85 R86 R87 R88 R89 R90 R91 R92 R93 R94 R113 R137 R138 R139 R140 R141 R142 R143 R144 R145 R146 R147 R148 R149 R150 R151 R152 R153 R154 R156 R157 R160 R161 R162 R163 R164 R165 R166 R167 R168 R169 R171 R172 R173 R174 R175 R176 R177 R178 R179 R180 R182 R185 R188 R190 R191 R192 R193 R194 R195 R196 R198 R199 R201 R202 R203 R204 R207 R208 R209 R210 R211 R212 R214 R215 SW6 SW7 U8 U9 U10 U11 U12 U13 U14 U16 U17 X2 X3
EVB-NORA-B206: not fitted C1 C2 C3 C4 C5 C42 C43 C44 C45 C46 C47 C55 J1 J5 J15 J16 R21 R26 R33 R34 R37 R38 R45 R46 R49 R50 R52 R55 R56 R70 R76 R78 R85 R94 R113 R137 R138 R139 R140 R141 R142 R143 R144 R145 R146 R150 R156 R158 R159 R164 R165 R166 R169 R170 R173 R174 R175 R181 R183 R184 R185 R186 R187 R188 R189 R190 R191 R192 R193 R194 R195 R196 R199 R201 R202 R203 R204 R209 R210 R211 R212 R213 R216 R217 R218 R221 R225 U11 U12 U13; alternate parts R84 -> UBXH18-0003002
EVB-NORA-B206_Only_FTDI: not fitted C1 C2 C3 C4 C5 C21 C22 C23 C24 C25 C26 C27 C28 C29 C30 C31 C32 C33 C34 C35 C36 C37 C38 C39 C40 C41 C42 C43 C44 C45 C46 C47 C52 C55 C56 C57 C58 C59 C61 D16 J1 J5 J9 J10 J15 J16 Q3 Q4 R21 R26 R33 R34 R37 R38 R45 R46 R47 R49 R50 R52 R55 R56 R70 R76 R78 R79 R80 R81 R82 R83 R84 R85 R86 R87 R88 R89 R90 R91 R92 R93 R94 R113 R137 R138 R139 R140 R141 R142 R143 R144 R145 R146 R147 R148 R149 R150 R151 R152 R153 R154 R156 R157 R158 R159 R160 R161 R162 R163 R169 R173 R174 R175 R181 R183 R184 R185 R186 R187 R188 R189 R190 R191 R192 R193 R194 R195 R196 R199 R201 R202 R203 R204 R207 R208 R209 R210 R211 R212 R214 R215 R217 R225 U8 U9 U10 U11 U12 U13 U14 X2 X3
EVB-NORA-B201_Only_FTDI: not fitted C1 C2 C3 C4 C5 C21 C22 C23 C24 C25 C26 C27 C28 C29 C30 C31 C32 C33 C34 C35 C36 C37 C38 C39 C40 C41 C42 C43 C44 C45 C46 C47 C52 C55 C56 C57 C58 C59 C61 D16 J5 J9 J10 J15 J16 Q3 Q4 R21 R26 R33 R34 R37 R38 R45 R46 R47 R49 R50 R52 R55 R56 R70 R76 R78 R79 R80 R81 R82 R83 R84 R85 R86 R87 R88 R89 R90 R91 R92 R93 R94 R113 R137 R138 R139 R140 R141 R142 R143 R144 R145 R146 R147 R148 R149 R150 R151 R152 R153 R154 R156 R157 R158 R159 R160 R161 R162 R163 R169 R173 R174 R175 R181 R183 R184 R185 R186 R187 R188 R189 R190 R191 R192 R193 R194 R195 R196 R199 R201 R202 R203 R204 R207 R208 R209 R210 R211 R212 R214 R215 R217 R225 U8 U9 U10 U11 U12 U13 U14 X2 X3
EVB-NORA-B201: not fitted C1 C2 C3 C4 C5 C42 C43 C44 C45 C46 C47 C55 J5 J15 J16 R21 R26 R33 R34 R37 R38 R45 R46 R49 R50 R52 R55 R56 R70 R76 R78 R85 R94 R113 R137 R138 R139 R140 R141 R142 R143 R144 R145 R146 R150 R156 R158 R159 R164 R165 R166 R169 R170 R173 R174 R175 R181 R183 R184 R185 R186 R187 R188 R189 R190 R191 R192 R193 R194 R195 R196 R199 R201 R202 R203 R204 R209 R210 R211 R212 R213 R216 R217 R218 R221 R225 U11 U12 U13; alternate parts R84 -> UBXH18-0003002
EVB-NORA-B201_Only_OBD: not fitted C1 C2 C3 C4 C5 C42 C43 C44 C45 C46 C47 C52 C53 C54 C55 C56 C57 C58 C59 C60 C61 F2 J5 J15 J16 R21 R26 R33 R34 R37 R38 R45 R46 R49 R50 R52 R55 R56 R70 R76 R78 R85 R94 R113 R137 R138 R139 R140 R141 R142 R143 R144 R147 R148 R149 R150 R151 R152 R153 R154 R155 R156 R157 R158 R159 R160 R161 R162 R163 R164 R165 R166 R169 R170 R173 R174 R175 R181 R183 R184 R185 R186 R187 R188 R189 R190 R191 R192 R199 R201 R202 R203 R204 R213 R216 R217 R218 R221 R225 U11 U12 U13 U14 U15 X3; alternate parts R84 -> UBXH18-0003002
EVB-NORA-B206_Only_OBD: not fitted C1 C2 C3 C4 C5 C42 C43 C44 C45 C46 C47 C52 C53 C54 C55 C56 C57 C58 C59 C60 C61 F2 J1 J5 J15 J16 R21 R26 R33 R34 R37 R38 R45 R46 R49 R50 R52 R55 R56 R70 R76 R78 R85 R94 R113 R137 R138 R139 R140 R141 R142 R143 R144 R147 R148 R149 R150 R151 R152 R153 R154 R155 R156 R157 R158 R159 R160 R161 R162 R163 R164 R165 R166 R169 R170 R173 R174 R175 R181 R183 R184 R185 R186 R187 R188 R189 R190 R191 R192 R199 R201 R202 R203 R204 R213 R216 R217 R218 R221 R225 U11 U12 U13 U14 U15 X3; alternate parts R84 -> UBXH18-0003002